# Altium project F429_PCB.PrjPcb
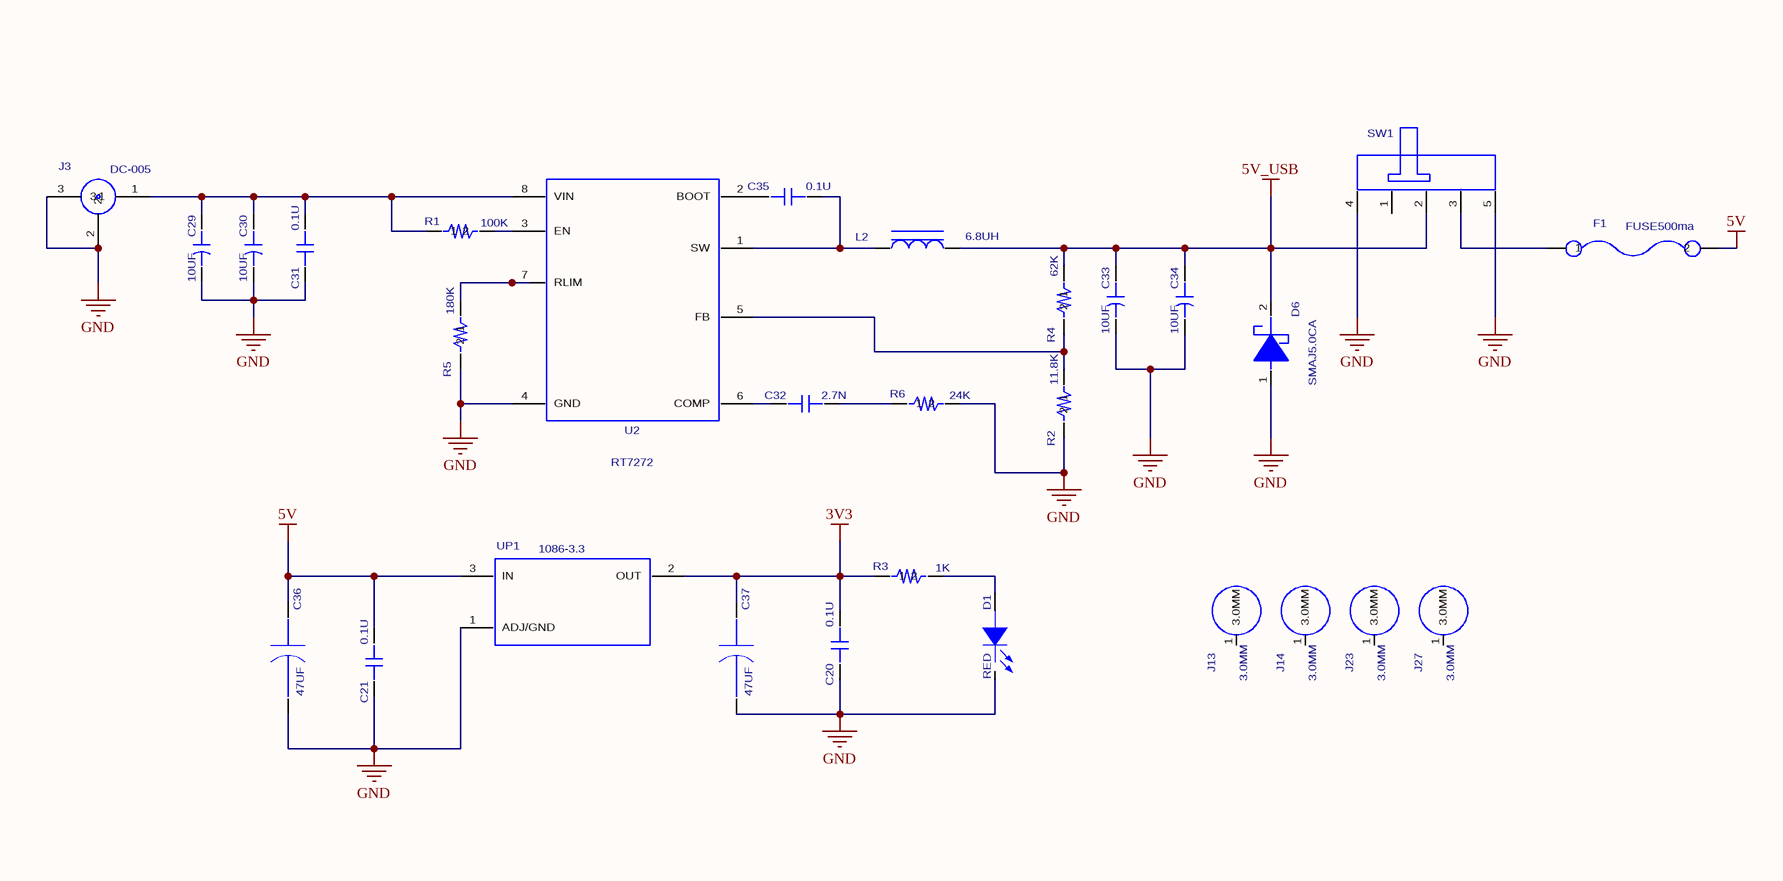
[diagram p0: Sheet1.SchDoc, top left]
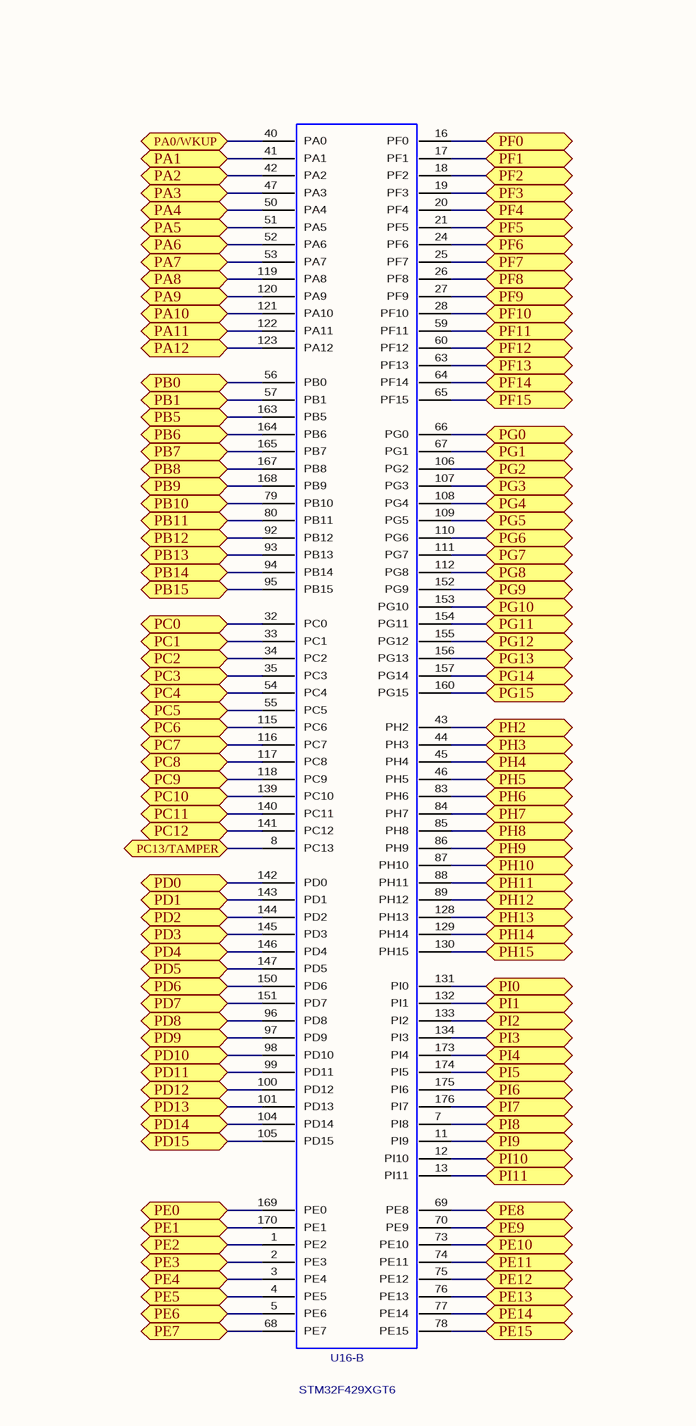
[diagram p1: Sheet1.SchDoc, top middle]
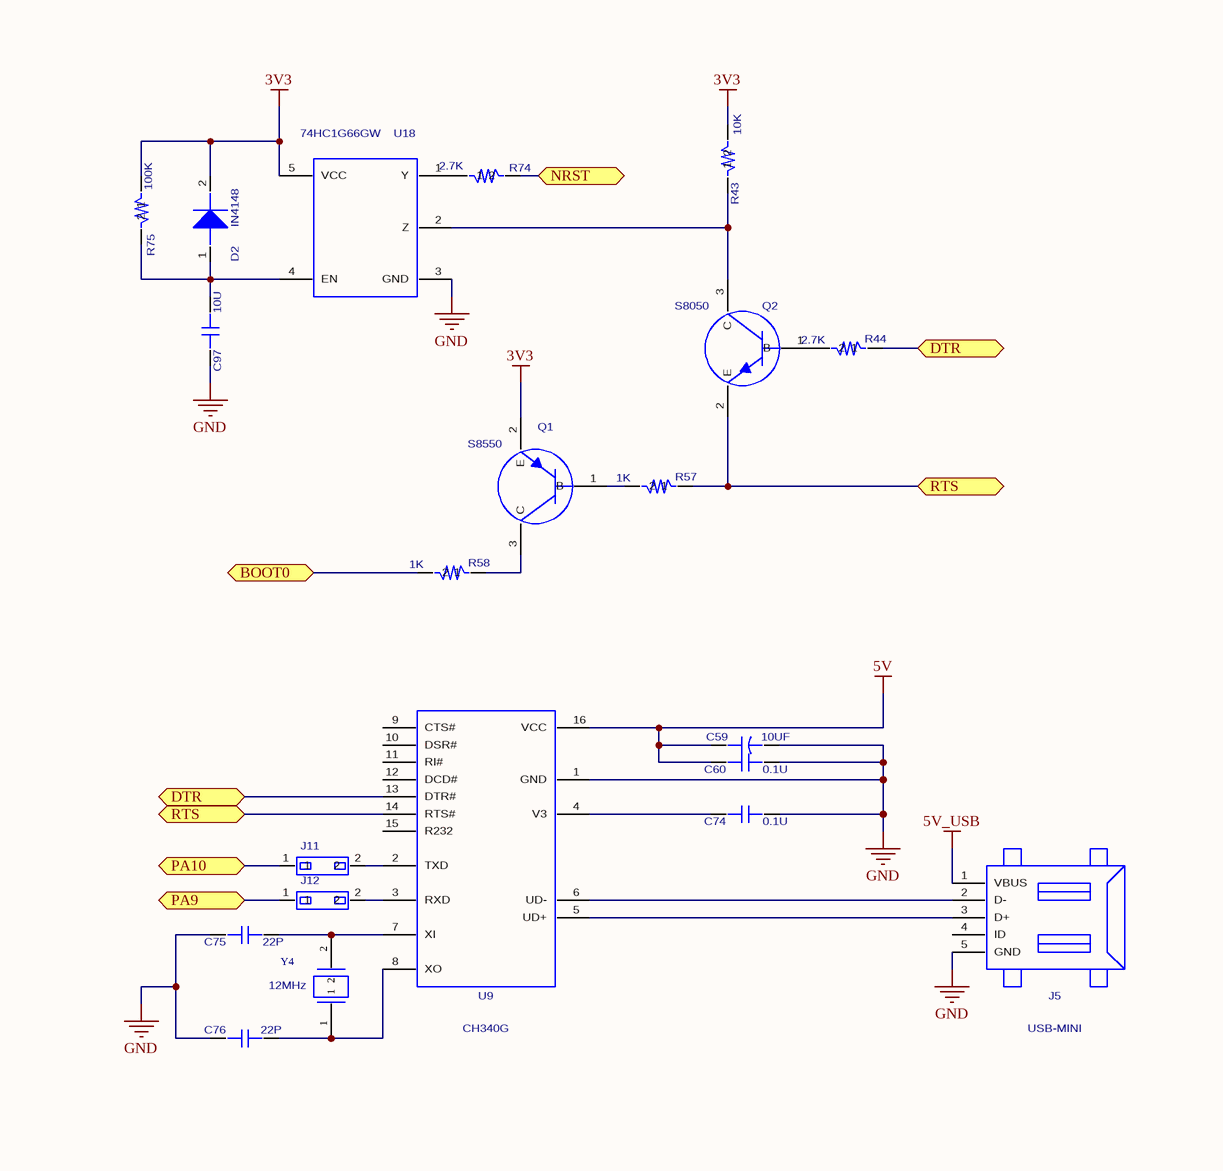
[diagram p2: Sheet1.SchDoc, top right]
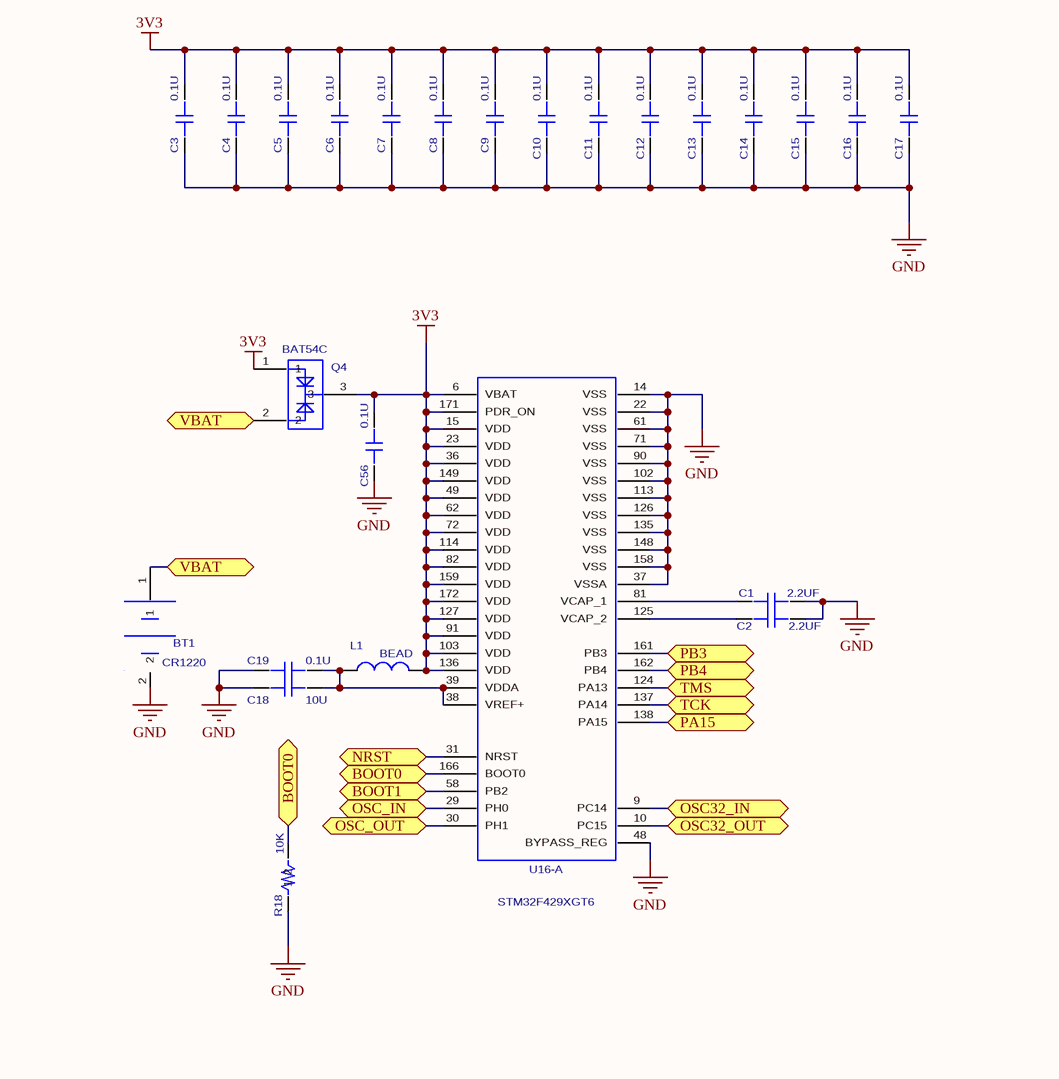
[diagram p3: Sheet1.SchDoc, centre left]
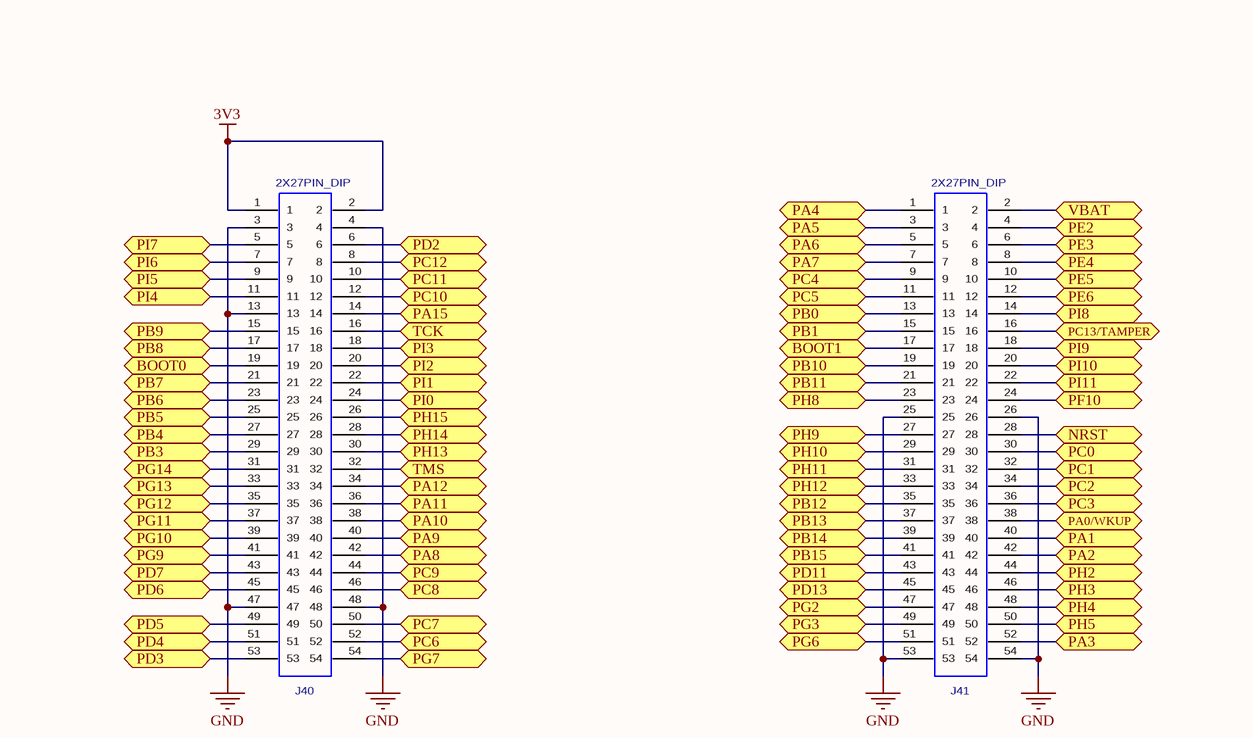
[diagram p4: Sheet1.SchDoc, centre middle]
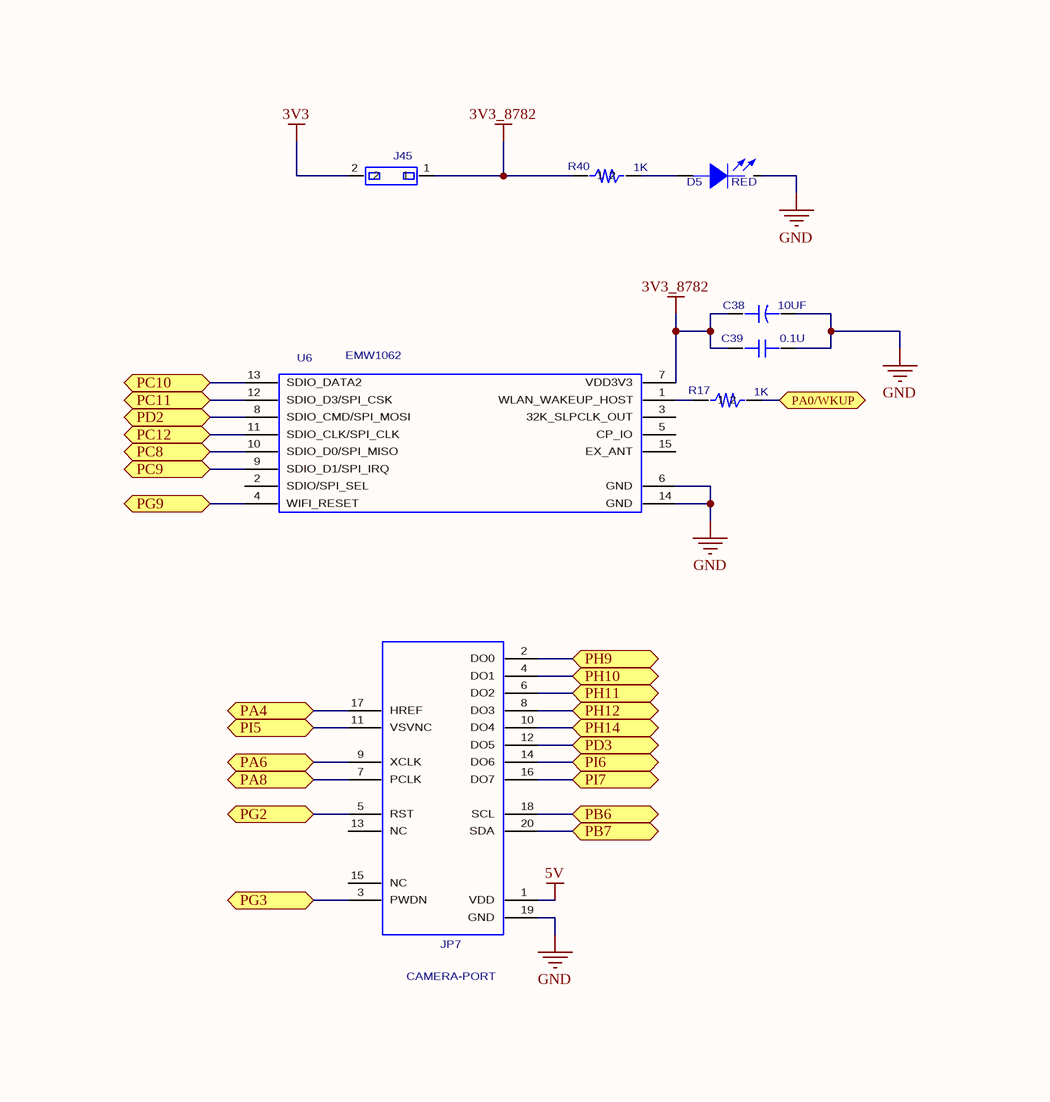
[diagram p5: Sheet1.SchDoc, centre right]
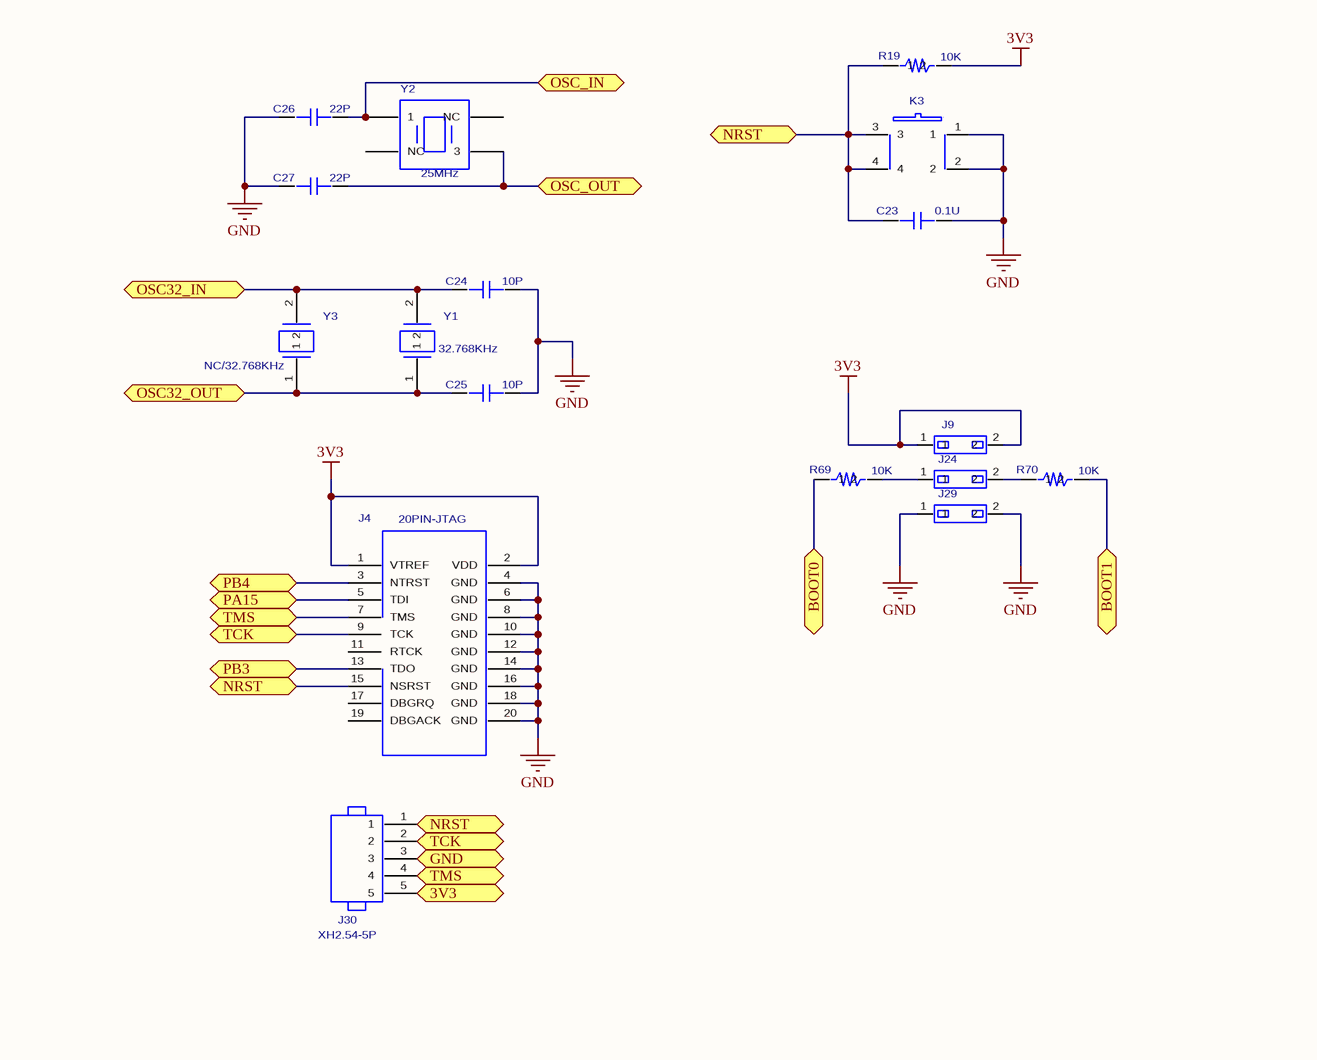
[diagram p6: Sheet1.SchDoc, bottom left]
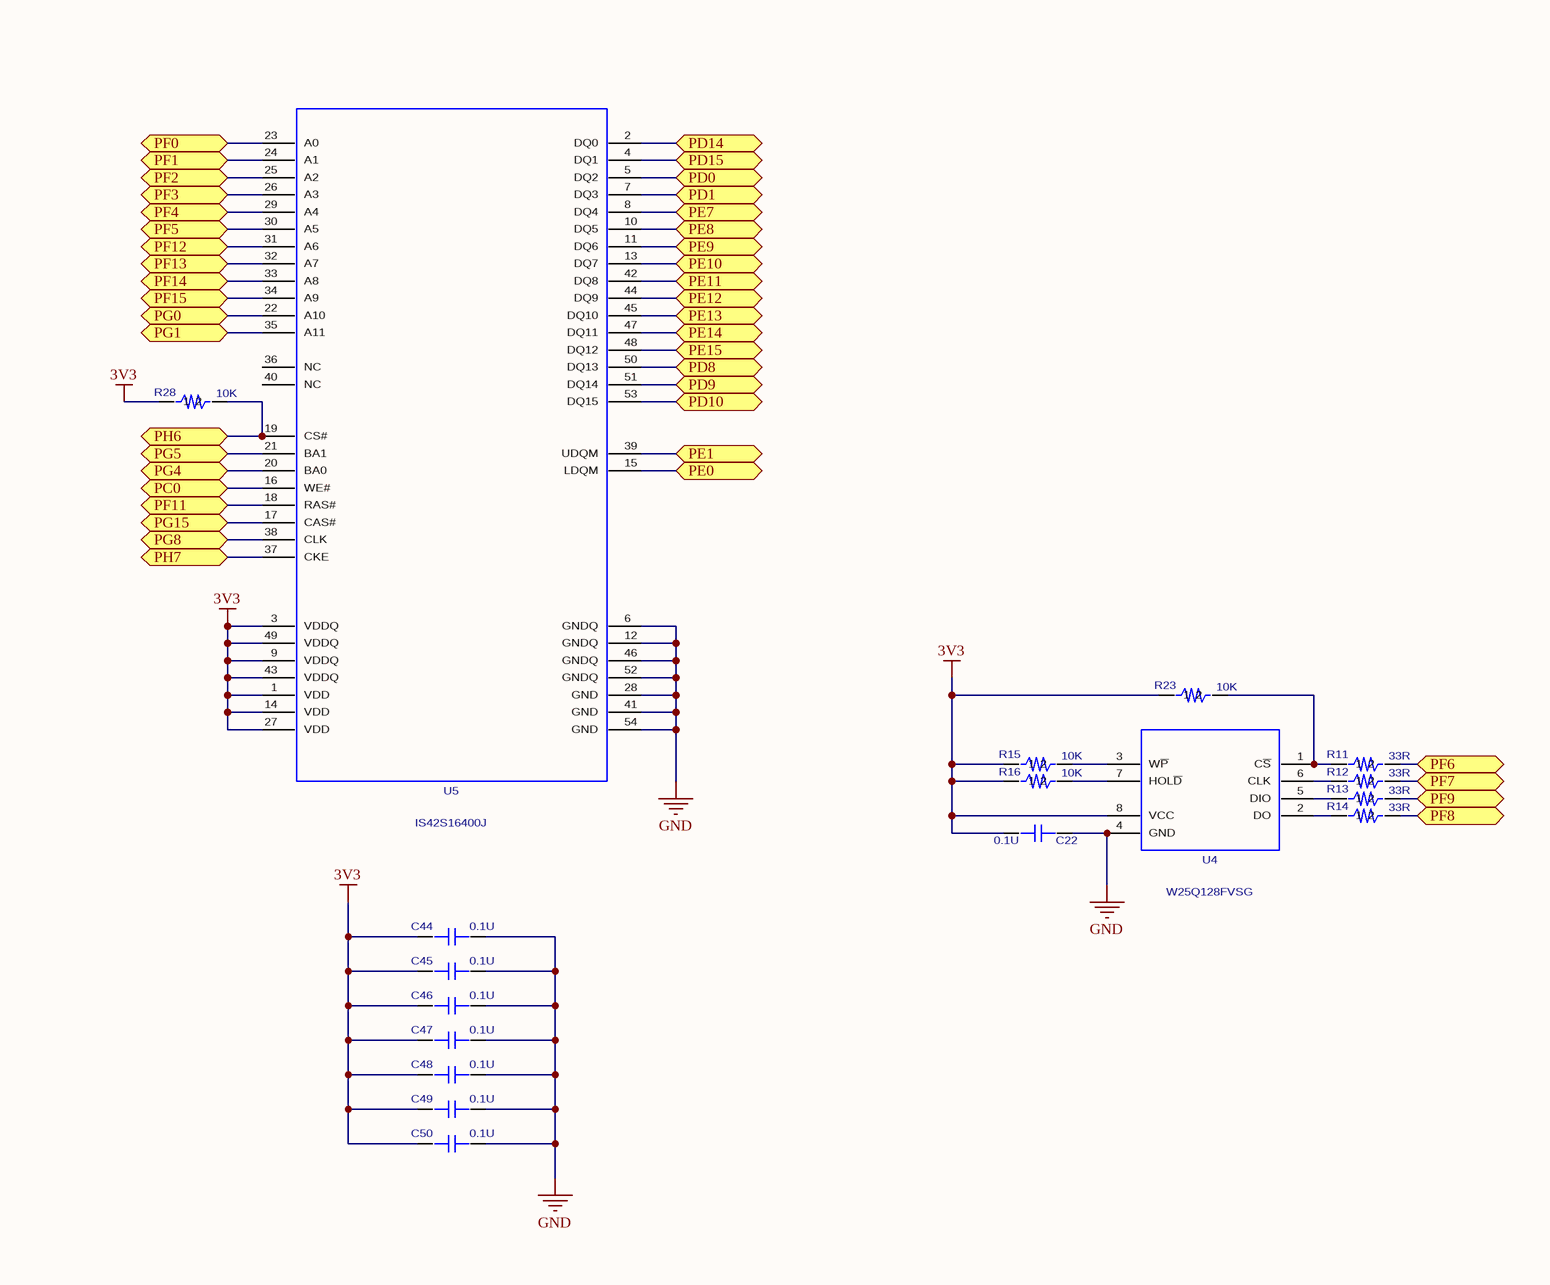
[diagram p7: Sheet1.SchDoc, bottom right]
1 sheet, 120 parts. Net scope: flat (ports and power ports of the same name join across sheets).
Board file: Board_PCB.PcbDoc

## Sheet Sheet1.SchDoc
size A1

### Parts
BT1  CR1220  [BATERY]
C1  value 2.2UF  [CAP_0603_FIRE]  (hidden comment: C_2.2UF_0603)
C2  value 2.2UF  [CAP_0603_FIRE]  (hidden comment: C_2.2UF_0603)
C3  value 0.1U  [C_0603]  (hidden comment: C_0.1UF_0603)
C4  value 0.1U  [C_0603]  (hidden comment: C_0.1UF_0603)
C5  value 0.1U  [C_0603]  (hidden comment: C_0.1UF_0603)
C6  value 0.1U  [C_0603]  (hidden comment: C_0.1UF_0603)
C7  value 0.1U  [C_0603]  (hidden comment: C_0.1UF_0603)
C8  value 0.1U  [C_0603]  (hidden comment: C_0.1UF_0603)
C9  value 0.1U  [C_0603]  (hidden comment: C_0.1UF_0603)
C10  value 0.1U  [C_0603]  (hidden comment: C_0.1UF_0603)
C11  value 0.1U  [C_0603]  (hidden comment: C_0.1UF_0603)
C12  value 0.1U  [C_0603]  (hidden comment: C_0.1UF_0603)
C13  value 0.1U  [C_0603]  (hidden comment: C_0.1UF_0603)
C14  value 0.1U  [C_0603]  (hidden comment: C_0.1UF_0603)
C15  value 0.1U  [C_0603]  (hidden comment: C_0.1UF_0603)
C16  value 0.1U  [C_0603]  (hidden comment: C_0.1UF_0603)
C17  value 0.1U  [C_0603]  (hidden comment: C_0.1UF_0603)
C18  value 10U  [C_0603]  (hidden comment: C_10UF_0603)
C19  value 0.1U  [C_0603]  (hidden comment: C_0.1UF_0603)
C20  value 0.1U  [C_0603]  (hidden comment: C_0.1UF_0603)
C21  value 0.1U  [C_0603]  (hidden comment: C_0.1UF_0603)
C22  value 0.1U  [C_0603]  (hidden comment: C_0.1UF_0603)
C23  value 0.1U  [C_0603]  (hidden comment: C_0.1UF_0603)
C24  value 10P  [C_0603]  (hidden comment: C_10P_0603)
C25  value 10P  [C_0603]  (hidden comment: C_10P_0603)
C26  value 22P  [C_0603]  (hidden comment: C_22P_0603)
C27  value 22P  [C_0603]  (hidden comment: C_22P_0603)
C29  value 10UF  [AVX_B_3528-21]  (hidden comment: C+_10UF_B)
C30  value 10UF  [AVX_B_3528-21]  (hidden comment: C+_10UF_B)
C31  value 0.1U  [C_0603]  (hidden comment: C_0.1UF_0603)
C32  value 2.7N  [C_0603]  (hidden comment: C_2.7NF_0603)
C33  value 10UF  [AVX_B_3528-21]  (hidden comment: C+_10UF_B)
C34  value 10UF  [AVX_B_3528-21]  (hidden comment: C+_10UF_B)
C35  value 0.1U  [C_0603]  (hidden comment: C_0.1UF_0603)
C36  value 47UF  [EC_47UF_6.5X6.5]  (hidden comment: CAP+_47UF_6.5X6.5)
C37  value 47UF  [EC_47UF_6.5X6.5]  (hidden comment: CAP+_47UF_6.5X6.5)
C38  value 10UF  [AVX_B_3528-21]  (hidden comment: C+_10UF_B)
C39  value 0.1U  [C_0603]  (hidden comment: C_0.1UF_0603)
C44  value 0.1U  [C_0603]  (hidden comment: C_0.1UF_0603)
C45  value 0.1U  [C_0603]  (hidden comment: C_0.1UF_0603)
C46  value 0.1U  [C_0603]  (hidden comment: C_0.1UF_0603)
C47  value 0.1U  [C_0603]  (hidden comment: C_0.1UF_0603)
C48  value 0.1U  [C_0603]  (hidden comment: C_0.1UF_0603)
C49  value 0.1U  [C_0603]  (hidden comment: C_0.1UF_0603)
C50  value 0.1U  [C_0603]  (hidden comment: C_0.1UF_0603)
C56  value 0.1U  [C_0603]  (hidden comment: C_0.1UF_0603)
C59  value 10UF  [C_0603]  (hidden comment: C_10UF)
C60  value 0.1U  [C_0603]  (hidden comment: C_0.1UF_0603)
C74  value 0.1U  [C_0603]  (hidden comment: C_0.1UF_0603)
C75  value 22P  [C_0603]  (hidden comment: C_22P_0603)
C76  value 22P  [C_0603]  (hidden comment: C_22P_0603)
C97  value 10U  [C_0603]  (hidden comment: C_10UF_0603)
D1  value RED  [LED_0603]  (hidden comment: LED_RED_0603)
D2  IN4148  [DIODE_SOP]
D5  value RED  [LED_0603]  (hidden comment: LED_RED_0603)
D6  SMAJ5.0CA  [DO-214]
F1  FUSE500MA  [C1812]
J3  DC-005  [DC-005]
J4  20PIN-JTAG  [20PIN-JTAG]
J5  USB-MINI  [USB-MINI]
J9  1X2PIN_SMD  [1X2PIN_SMD]  (value not drawn)
J11  1X2PIN_SMD  [1X2PIN_SMD]  (value not drawn)
J12  1X2PIN_SMD  [1X2PIN_SMD]  (value not drawn)
J13  3.0MM  [3.0MM]
J14  3.0MM  [3.0MM]
J23  3.0MM  [3.0MM]
J24  1X2PIN_SMD  [1X2PIN_SMD]  (value not drawn)
J27  3.0MM  [3.0MM]
J29  1X2PIN_SMD  [1X2PIN_SMD]  (value not drawn)
J30  XH2.54-5P  [XH2.54-5P]
J40  2X27PIN_DIP  [2X27X2.54MM]
J41  2X27PIN_DIP  [2X27X2.54MM]
J45  1X2PIN_SMD  [1X2PIN_SMD]  (value not drawn)
JP7  CAMERA-PORT  [20PIN_2.54_DIP_BOT]
K3  KEY  [SW6.2/6.2-SMD]  (value not drawn)
L1  value BEAD  [R_0603]  (hidden comment: BEAD-0603)
L2  value 6.8UH  [GDCD4532]  (hidden comment: L_6.8UH_4532)
Q1  S8550  [SOT-23]
Q2  S8050  [SOT-23]
Q4  BAT54C  [SOT-23]
R1  value 100K  [R_0603]  (hidden comment: R_100K_0603)
R2  value 11.8K  [R_0603]  (hidden comment: R_11.8K_0603)
R3  value 1K  [R_0603]  (hidden comment: R_1K_0603)
R4  value 62K  [R_0603]  (hidden comment: R_62K_0603)
R5  value 180K  [R_0603]  (hidden comment: R_180K_0603)
R6  value 24K  [R_0603]  (hidden comment: R_24K_0603)
R11  value 33R  [SR0402]  (hidden comment: R_33R_0402)
R12  value 33R  [SR0402]  (hidden comment: R_33R_0402)
R13  value 33R  [SR0402]  (hidden comment: R_33R_0402)
R14  value 33R  [SR0402]  (hidden comment: R_33R_0402)
R15  value 10K  [R_0603]  (hidden comment: R_10K_0603)
R16  value 10K  [R_0603]  (hidden comment: R_10K_0603)
R17  value 1K  [R_0603]  (hidden comment: R_1K_0603)
R18  value 10K  [R_0603]  (hidden comment: R_10K_0603)
R19  value 10K  [R_0603]  (hidden comment: R_10K_0603)
R23  value 10K  [R_0603]  (hidden comment: R_10K_0603)
R28  value 10K  [R_0603]  (hidden comment: R_10K_0603)
R40  value 1K  [R_0603]  (hidden comment: R_1K_0603)
R43  value 10K  [R_0603]  (hidden comment: R_10K_0603)
R44  value 2.7K  [R_0603]  (hidden comment: R_2.7K_0603)
R57  value 1K  [R_0603]  (hidden comment: R_1K_0603)
R58  value 1K  [R_0603]  (hidden comment: R_1K_0603)
R69  value 10K  [R_0603]  (hidden comment: R_10K_0603)
R70  value 10K  [R_0603]  (hidden comment: R_10K_0603)
R74  value 2.7K  [R_0603]  (hidden comment: R_2.7K_0603)
R75  value 100K  [R_0603]  (hidden comment: R_100K_0603)
SW1  SW-POWER  [SW13_6]  (value not drawn)
U2  RT7272  [RT7272]
U4  W25Q128FVSG  [W25X16]
U5  IS42S16400J  [TSOP-54]
U6  EMW1062  [EMW1062]
U9  CH340G  [SOP16]
U16-  STM32F429XGT6  [LQFP176]  (parts A,B of 2)
U18  74HC1G66GW  [SOT-353]
UP1  1086-3.3  [TO-252-2L]
Y1  value 32.768KHz  [CRYS-3X8]  (hidden comment: XTAL_32.768KHZ)
Y2  value 25MHz  [CRYSTAL_25MHZ]  (hidden comment: CRYSTAL_25MHZ)
Y3  value NC/32.768KHz  [3215]  (hidden comment: NC/XTAL_32.768KHZ_3215)
Y4  value 12MHz  [XTAL_SMD]  (hidden comment: XTAL_12M)

### Ports
3V3, BOOT0, BOOT1, DTR, GND, NRST, OSC32_IN, OSC32_OUT, OSC_IN, OSC_OUT, PA0/WKUP, PA1, PA2, PA3, PA4, PA5, PA6, PA7, PA8, PA9, PA10, PA11, PA12, PA15, PB0, PB1, PB3, PB4, PB5, PB6, PB7, PB8, PB9, PB10, PB11, PB12, PB13, PB14, PB15, PC0, PC1, PC2, PC3, PC4, PC5, PC6, PC7, PC8, PC9, PC10, PC11, PC12, PC13/TAMPER, PD0, PD1, PD2, PD3, PD4, PD5, PD6, PD7, PD8, PD9, PD10, PD11, PD12, PD13, PD14, PD15, PE0, PE1, PE2, PE3, PE4, PE5, PE6, PE7, PE8, PE9, PE10, PE11, PE12, PE13, PE14, PE15, PF0, PF1, PF2, PF3, PF4, PF5, PF6, PF7, PF8, PF9, PF10, PF11, PF12, PF13, PF14, PF15, PG0, PG1, PG2, PG3, PG4, PG5, PG6, PG7, PG8, PG9, PG10, PG11, PG12, PG13, PG14, PG15, PH2, PH3, PH4, PH5, PH6, PH7, PH8, PH9, PH10, PH11, PH12, PH13, PH14, PH15, PI0, PI1, PI2, PI3, PI4, PI5, PI6, PI7, PI8, PI9, PI10, PI11, RTS, TCK, TMS, VBAT

### Nets
3V3: C3.1 C4.1 C5.1 C6.1 C7.1 C8.1 C9.1 C10.1 C11.1 C12.1 C13.1 C14.1 C15.1 C16.1 C17.1 C20.1 C22.1 C37.1 C44.2 C45.2 C46.2 C47.2 C48.2 C49.2 C50.2 C56.1 D2.2(-) J4.1(VTREF) J4.2(VDD) J9.1 J9.2 J40.1 J40.2 J45.2 L1.2 Q1.2(E) Q4.1 Q4.3 R3.1 R15.1 R16.1 R19.2 R23.1 R28.1 R43.2 R75.1 U4.8(VCC) U5.1(VDD) U5.3(VDDQ) U5.9(VDDQ) U5.14(VDD) U5.27(VDD) U5.43(VDDQ) U5.49(VDDQ) U16-.6(VBAT) U16-.15(VDD) U16-.23(VDD) U16-.36(VDD) U16-.49(VDD) U16-.62(VDD) U16-.72(VDD) U16-.82(VDD) U16-.91(VDD) U16-.103(VDD) U16-.114(VDD) U16-.127(VDD) U16-.136(VDD) U16-.149(VDD) U16-.159(VDD) U16-.171(PDR_ON) U16-.172(VDD) U18.5(VCC) UP1.2(OUT)
3V3_8782: C38.1(+) C39.2 J45.1 R40.1 U6.7(VDD3V3)
5V: C21.1 C36.1 C59.1(+) C60.2 F1.2 JP7.1(VDD) U9.16(VCC) UP1.3(IN)
5V_USB: C33.1(+) C34.1(+) D6.2(-) J5.1(VBUS) L2.2 R4.1 SW1.2
GND: BT1.2 C1.2 C2.2 C3.2 C4.2 C5.2 C6.2 C7.2 C8.2 C9.2 C10.2 C11.2 C12.2 C13.2 C14.2 C15.2 C16.2 C17.2 C18.2 C19.2 C20.2 C21.2 C22.2 C23.1 C24.2 C25.2 C26.1 C27.1 C29.2(-) C30.2(-) C31.2 C33.2(-) C34.2(-) C36.2 C37.2 C38.2(-) C39.1 C44.1 C45.1 C46.1 C47.1 C48.1 C49.1 C50.1 C56.2 C59.2(-) C60.1 C74.1 C75.1 C76.1 C97.1 D1.K(CATHODE) D5.K(CATHODE) D6.1(+) J3.2 J3.3 J4.4(GND) J4.6(GND) J4.8(GND) J4.10(GND) J4.12(GND) J4.14(GND) J4.16(GND) J4.18(GND) J4.20(GND) J5.5(GND) J29.1 J29.2 J40.3 J40.4 J40.13 J40.47 J40.48 J41.25 J41.26 J41.53 J41.54 JP7.19(GND) K3.1 K3.2 R2.2 R5.2 R6.2 R18.1 SW1.4 SW1.5 U2.4(GND) U4.4(GND) U5.6(GNDQ) U5.12(GNDQ) U5.28(GND) U5.41(GND) U5.46(GNDQ) U5.52(GNDQ) U5.54(GND) U6.6(GND) U6.14(GND) U9.1(GND) U16-.14(VSS) U16-.22(VSS) U16-.37(VSSA) U16-.48(BYPASS_REG) U16-.61(VSS) U16-.71(VSS) U16-.90(VSS) U16-.102(VSS) U16-.113(VSS) U16-.126(VSS) U16-.135(VSS) U16-.148(VSS) U16-.158(VSS) U18.3(GND) UP1.1(ADJ/GND)
NetBT1_1: BT1.1 J41.2 Q4.2 ; port VBAT
NetC1_1: C1.1 U16-.81(VCAP_1)
NetC2_1: C2.1 U16-.125(VCAP_2)
NetC18_1: C18.1 C19.1 L1.1 U16-.38(VREF+) U16-.39(VDDA)
NetC23_2: C23.2 J4.15(NSRST) J30.1 J41.28 K3.3 K3.4 R19.1 R74.2 U16-.31(NRST) ; port NRST
NetC24_1: C24.1 U16-.9(PC14) Y1.2 Y3.2 ; port OSC32_IN
NetC25_1: C25.1 U16-.10(PC15) Y1.1 Y3.1 ; port OSC32_OUT
NetC26_2: C26.2 U16-.29(PH0) Y2.1 ; port OSC_IN
NetC27_2: C27.2 U16-.30(PH1) Y2.3 ; port OSC_OUT
NetC29_1: C29.1(+) C30.1(+) C31.1 J3.1 R1.1 U2.8(VIN)
NetC32_1: C32.1 U2.6(COMP)
NetC32_2: C32.2 R6.1
NetC35_1: C35.1 L2.1 U2.1(SW)
NetC35_2: C35.2 U2.2(BOOT)
NetC74_2: C74.2 U9.4(V3)
NetC75_2: C75.2 U9.7(XI) Y4.2
NetC76_2: C76.2 U9.8(XO) Y4.1
NetC97_2: C97.2 D2.1(+) R75.2 U18.4(EN)
NetD1_A: D1.A(ANODE) R3.2
NetD5_A: D5.A(ANODE) R40.2
NetF1_1: F1.1 SW1.3
NetJ4_3: J4.3(NTRST) J40.27 U16-.162(PB4) ; port PB4
NetJ4_5: J4.5(TDI) J40.14 U16-.138(PA15) ; port PA15
NetJ4_7: J4.7(TMS) J30.4 J40.32 U16-.124(PA13) ; port TMS
NetJ4_9: J4.9(TCK) J30.2 J40.16 U16-.137(PA14) ; port TCK
NetJ4_13: J4.13(TDO) J40.29 U16-.161(PB3) ; port PB3
NetJ5_2: J5.2(D-) U9.6(UD-)
NetJ5_3: J5.3(D+) U9.5(UD+)
NetJ11_1: J11.1 J40.38 U16-.121(PA10) ; port PA10
NetJ11_2: J11.2 U9.2(TXD)
NetJ12_1: J12.1 J40.40 U16-.120(PA9) ; port PA9
NetJ12_2: J12.2 U9.3(RXD)
NetJ24_1: J24.1 R69.2
NetJ24_2: J24.2 R70.1
NetJ30_3: J30.3 ; port GND
NetJ30_5: J30.5 ; port 3V3
NetJ40_5: J40.5 JP7.16(DO7) U16-.176(PI7) ; port PI7
NetJ40_6: J40.6 U6.8(SDIO_CMD/SPI_MOSI) U16-.144(PD2) ; port PD2
NetJ40_7: J40.7 JP7.14(DO6) U16-.175(PI6) ; port PI6
NetJ40_8: J40.8 U6.11(SDIO_CLK/SPI_CLK) U16-.141(PC12) ; port PC12
NetJ40_9: J40.9 JP7.11(VSVNC) U16-.174(PI5) ; port PI5
NetJ40_10: J40.10 U6.12(SDIO_D3/SPI_CSK) U16-.140(PC11) ; port PC11
NetJ40_11: J40.11 U16-.173(PI4) ; port PI4
NetJ40_12: J40.12 U6.13(SDIO_DATA2) U16-.139(PC10) ; port PC10
NetJ40_15: J40.15 U16-.168(PB9) ; port PB9
NetJ40_17: J40.17 U16-.167(PB8) ; port PB8
NetJ40_18: J40.18 U16-.134(PI3) ; port PI3
NetJ40_19: J40.19 R18.2 R58.2 R69.1 U16-.166(BOOT0) ; port BOOT0
NetJ40_20: J40.20 U16-.133(PI2) ; port PI2
NetJ40_21: J40.21 JP7.20(SDA) U16-.165(PB7) ; port PB7
NetJ40_22: J40.22 U16-.132(PI1) ; port PI1
NetJ40_23: J40.23 JP7.18(SCL) U16-.164(PB6) ; port PB6
NetJ40_24: J40.24 U16-.131(PI0) ; port PI0
NetJ40_25: J40.25 U16-.163(PB5) ; port PB5
NetJ40_26: J40.26 U16-.130(PH15) ; port PH15
NetJ40_28: J40.28 JP7.10(DO4) U16-.129(PH14) ; port PH14
NetJ40_30: J40.30 U16-.128(PH13) ; port PH13
NetJ40_31: J40.31 U16-.157(PG14) ; port PG14
NetJ40_33: J40.33 U16-.156(PG13) ; port PG13
NetJ40_34: J40.34 U16-.123(PA12) ; port PA12
NetJ40_35: J40.35 U16-.155(PG12) ; port PG12
NetJ40_36: J40.36 U16-.122(PA11) ; port PA11
NetJ40_37: J40.37 U16-.154(PG11) ; port PG11
NetJ40_39: J40.39 U16-.153(PG10) ; port PG10
NetJ40_41: J40.41 U6.4(WIFI_RESET) U16-.152(PG9) ; port PG9
NetJ40_42: J40.42 JP7.7(PCLK) U16-.119(PA8) ; port PA8
NetJ40_43: J40.43 U16-.151(PD7) ; port PD7
NetJ40_44: J40.44 U6.9(SDIO_D1/SPI_IRQ) U16-.118(PC9) ; port PC9
NetJ40_45: J40.45 U16-.150(PD6) ; port PD6
NetJ40_46: J40.46 U6.10(SDIO_D0/SPI_MISO) U16-.117(PC8) ; port PC8
NetJ40_49: J40.49 U16-.147(PD5) ; port PD5
NetJ40_50: J40.50 U16-.116(PC7) ; port PC7
NetJ40_51: J40.51 U16-.146(PD4) ; port PD4
NetJ40_52: J40.52 U16-.115(PC6) ; port PC6
NetJ40_53: J40.53 JP7.12(DO5) U16-.145(PD3) ; port PD3
NetJ40_54: J40.54 U16-.111(PG7) ; port PG7
NetJ41_1: J41.1 JP7.17(HREF) U16-.50(PA4) ; port PA4
NetJ41_3: J41.3 U16-.51(PA5) ; port PA5
NetJ41_4: J41.4 U16-.1(PE2) ; port PE2
NetJ41_5: J41.5 JP7.9(XCLK) U16-.52(PA6) ; port PA6
NetJ41_6: J41.6 U16-.2(PE3) ; port PE3
NetJ41_7: J41.7 U16-.53(PA7) ; port PA7
NetJ41_8: J41.8 U16-.3(PE4) ; port PE4
NetJ41_9: J41.9 U16-.54(PC4) ; port PC4
NetJ41_10: J41.10 U16-.4(PE5) ; port PE5
NetJ41_11: J41.11 U16-.55(PC5) ; port PC5
NetJ41_12: J41.12 U16-.5(PE6) ; port PE6
NetJ41_13: J41.13 U16-.56(PB0) ; port PB0
NetJ41_14: J41.14 U16-.7(PI8) ; port PI8
NetJ41_15: J41.15 U16-.57(PB1) ; port PB1
NetJ41_16: J41.16 U16-.8(PC13) ; port PC13/TAMPER
NetJ41_17: J41.17 R70.2 U16-.58(PB2) ; port BOOT1
NetJ41_18: J41.18 U16-.11(PI9) ; port PI9
NetJ41_19: J41.19 U16-.79(PB10) ; port PB10
NetJ41_20: J41.20 U16-.12(PI10) ; port PI10
NetJ41_21: J41.21 U16-.80(PB11) ; port PB11
NetJ41_22: J41.22 U16-.13(PI11) ; port PI11
NetJ41_23: J41.23 U16-.85(PH8) ; port PH8
NetJ41_24: J41.24 U16-.28(PF10) ; port PF10
NetJ41_27: J41.27 JP7.2(DO0) U16-.86(PH9) ; port PH9
NetJ41_29: J41.29 JP7.4(DO1) U16-.87(PH10) ; port PH10
NetJ41_30: J41.30 U5.16(WE#) U16-.32(PC0) ; port PC0
NetJ41_31: J41.31 JP7.6(DO2) U16-.88(PH11) ; port PH11
NetJ41_32: J41.32 U16-.33(PC1) ; port PC1
NetJ41_33: J41.33 JP7.8(DO3) U16-.89(PH12) ; port PH12
NetJ41_34: J41.34 U16-.34(PC2) ; port PC2
NetJ41_35: J41.35 U16-.92(PB12) ; port PB12
NetJ41_36: J41.36 U16-.35(PC3) ; port PC3
NetJ41_37: J41.37 U16-.93(PB13) ; port PB13
NetJ41_38: J41.38 R17.2 U16-.40(PA0) ; port PA0/WKUP
NetJ41_39: J41.39 U16-.94(PB14) ; port PB14
NetJ41_40: J41.40 U16-.41(PA1) ; port PA1
NetJ41_41: J41.41 U16-.95(PB15) ; port PB15
NetJ41_42: J41.42 U16-.42(PA2) ; port PA2
NetJ41_43: J41.43 U16-.99(PD11) ; port PD11
NetJ41_44: J41.44 U16-.43(PH2) ; port PH2
NetJ41_45: J41.45 U16-.101(PD13) ; port PD13
NetJ41_46: J41.46 U16-.44(PH3) ; port PH3
NetJ41_47: J41.47 JP7.5(RST) U16-.106(PG2) ; port PG2
NetJ41_48: J41.48 U16-.45(PH4) ; port PH4
NetJ41_49: J41.49 JP7.3(PWDN) U16-.107(PG3) ; port PG3
NetJ41_50: J41.50 U16-.46(PH5) ; port PH5
NetJ41_51: J41.51 U16-.110(PG6) ; port PG6
NetJ41_52: J41.52 U16-.47(PA3) ; port PA3
NetQ1_1: Q1.1(B) R57.2
NetQ1_3: Q1.3(C) R58.1
NetQ2_1: Q2.1(B) R44.2
NetQ2_2: Q2.2(E) R57.1 U9.14(RTS#) ; port RTS
NetQ2_3: Q2.3(C) R43.1 U18.2(Z)
NetR1_2: R1.2 U2.3(EN)
NetR2_1: R2.1 R4.2 U2.5(FB)
NetR5_1: R5.1 U2.7(RLIM)
NetR11_1: R11.1 R23.2 U4.1(C~{S})
NetR11_2: R11.2 U16-.24(PF6) ; port PF6
NetR12_1: R12.1 U4.6(CLK)
NetR12_2: R12.2 U16-.25(PF7) ; port PF7
NetR13_1: R13.1 U4.5(DIO)
NetR13_2: R13.2 U16-.27(PF9) ; port PF9
NetR14_1: R14.1 U4.2(DO)
NetR14_2: R14.2 U16-.26(PF8) ; port PF8
NetR15_2: R15.2 U4.3(W~{P})
NetR16_2: R16.2 U4.7(HOL~{D})
NetR17_1: R17.1 U6.1(WLAN_WAKEUP_HOST)
NetR28_2: R28.2 U5.19(CS#) U16-.83(PH6) ; port PH6
NetR44_1: R44.1 U9.13(DTR#) ; port DTR
NetR74_1: R74.1 U18.1(Y)
NetU5_2: U5.2(DQ0) U16-.104(PD14) ; port PD14
NetU5_4: U5.4(DQ1) U16-.105(PD15) ; port PD15
NetU5_5: U5.5(DQ2) U16-.142(PD0) ; port PD0
NetU5_7: U5.7(DQ3) U16-.143(PD1) ; port PD1
NetU5_8: U5.8(DQ4) U16-.68(PE7) ; port PE7
NetU5_10: U5.10(DQ5) U16-.69(PE8) ; port PE8
NetU5_11: U5.11(DQ6) U16-.70(PE9) ; port PE9
NetU5_13: U5.13(DQ7) U16-.73(PE10) ; port PE10
NetU5_15: U5.15(LDQM) U16-.169(PE0) ; port PE0
NetU5_17: U5.17(CAS#) U16-.160(PG15) ; port PG15
NetU5_18: U5.18(RAS#) U16-.59(PF11) ; port PF11
NetU5_20: U5.20(BA0) U16-.108(PG4) ; port PG4
NetU5_21: U5.21(BA1) U16-.109(PG5) ; port PG5
NetU5_22: U5.22(A10) U16-.66(PG0) ; port PG0
NetU5_23: U5.23(A0) U16-.16(PF0) ; port PF0
NetU5_24: U5.24(A1) U16-.17(PF1) ; port PF1
NetU5_25: U5.25(A2) U16-.18(PF2) ; port PF2
NetU5_26: U5.26(A3) U16-.19(PF3) ; port PF3
NetU5_29: U5.29(A4) U16-.20(PF4) ; port PF4
NetU5_30: U5.30(A5) U16-.21(PF5) ; port PF5
NetU5_31: U5.31(A6) U16-.60(PF12) ; port PF12
NetU5_32: U5.32(A7) U16-.63(PF13) ; port PF13
NetU5_33: U5.33(A8) U16-.64(PF14) ; port PF14
NetU5_34: U5.34(A9) U16-.65(PF15) ; port PF15
NetU5_35: U5.35(A11) U16-.67(PG1) ; port PG1
NetU5_37: U5.37(CKE) U16-.84(PH7) ; port PH7
NetU5_38: U5.38(CLK) U16-.112(PG8) ; port PG8
NetU5_39: U5.39(UDQM) U16-.170(PE1) ; port PE1
NetU5_42: U5.42(DQ8) U16-.74(PE11) ; port PE11
NetU5_44: U5.44(DQ9) U16-.75(PE12) ; port PE12
NetU5_45: U5.45(DQ10) U16-.76(PE13) ; port PE13
NetU5_47: U5.47(DQ11) U16-.77(PE14) ; port PE14
NetU5_48: U5.48(DQ12) U16-.78(PE15) ; port PE15
NetU5_50: U5.50(DQ13) U16-.96(PD8) ; port PD8
NetU5_51: U5.51(DQ14) U16-.97(PD9) ; port PD9
NetU5_53: U5.53(DQ15) U16-.98(PD10) ; port PD10
NetU16-_100: U16-.100(PD12) ; port PD12

Not connected (* = marked no-connect by the designer): J4 11(RTCK) 17(DBGRQ) 19(DBGACK); J5 4(ID); J13 1(3.0MM); J14 1(3.0MM); J23 1(3.0MM); J27 1(3.0MM); JP7 13(NC) 15(NC); SW1 1; U5 36(NC) 40(NC); U6 2(SDIO/SPI_SEL) 3(32K_SLPCLK_OUT) 5(CP_IO) 15(EX_ANT); U9 9(CTS#) 10(DSR#) 11(RI#) 12(DCD#) 15(R232); Y2 2(NC) 4(NC)

### Library data of the parts
D6 = SMAJ5.0CA: SMAJ5.0CA-E3/61 400W 5V; Manufacture 1 P/N: SMAJ5.0CA; Value: SMAJ5.0CA; PCB DECAL: DO-214
F1 = FUSE500MA: Assembly: SMD; Manufacture 1 P/N: FUSE500ma; PCB DECAL: C1812; Value: FUSE500ma
J40 J41 = 2X27PIN_DIP: value: 2X27PIN_DIP_2.54MM; PCB DECAL: 2X27X2.54MM
Q1 = S8550: NPN; Manufacturer #2: 8050; PCB DECAL: SOT-23
Q2 = S8050: NPN; Manufacturer #2: 8050; PCB DECAL: SOT-23
SW1 = SW-POWER: SW-5; Manufacturer #1 PN: SW-5; PCB DECAL: SW13_6
UP1 = 1086-3.3: Manufacturer #1: AMS; Manufacturer #1 PN: 1086-3.3; PCB DECAL: TO-252-2L
Y3 = NC/XTAL_32.768KHZ_3215: CRYSTAL; PCB DECAL: 3215
BT1 = CR1220: PCB DECAL: BATERY
C1 C2 = C_2.2UF_0603: PCB DECAL: CAP_0603_FIRE
C3-C17 C19-C23 C31 C35 C39 C44-C50 C56 C60 C74 = C_0.1UF_0603: PCB DECAL: C_0603
C18 C97 = C_10UF_0603: PCB DECAL: C_0603
C24 C25 = C_10P_0603: PCB DECAL: C_0603
C26 C27 C75 C76 = C_22P_0603: PCB DECAL: C_0603
C29 C30 C33 C34 C38 = C+_10UF_B: PCB DECAL: AVX_B_3528-21
C32 = C_2.7NF_0603: PCB DECAL: C_0603
C36 C37 = CAP+_47UF_6.5X6.5: PCB DECAL: EC_47UF_6.5X6.5
C59 = C_10UF: PCB DECAL: C_0603
D1 D5 = LED_RED_0603: PCB DECAL: LED_0603
D2 = IN4148: PCB DECAL: DIODE_SOP; VALUE: IN4148
J3 = DC-005: PCB DECAL: DC-005
J4 = 20PIN-JTAG: PCB DECAL: 20PIN-JTAG
J5 = USB-MINI: PCB DECAL: USB-MINI
J9 J11 J12 J24 J29 J45 = 1X2PIN_SMD: PCB DECAL: 1X2PIN_SMD
J13 J14 J23 J27 = 3.0MM: PCB DECAL: 3.0MM
J30 = XH2.54-5P: PCB DECAL: XH2.54-5P
JP7 = CAMERA-PORT: Manufacture 1 P/N: CAMERA-PORT; PCB DECAL: 20PIN_2.54_DIP_BOT
K3 = KEY: Manufacturer #1 PN: KEY; PCB DECAL: SW6.2/6.2-SMD
L1 = BEAD-0603: PCB DECAL: R_0603
L2 = L_6.8UH_4532: PCB DECAL: GDCD4532
Q4 = BAT54C: Value: BAT54C; PCB DECAL: SOT-23
R1 R75 = R_100K_0603: PCB DECAL: R_0603
R2 = R_11.8K_0603: PCB DECAL: R_0603
R3 R17 R40 R57 R58 = R_1K_0603: PCB DECAL: R_0603
R4 = R_62K_0603: PCB DECAL: R_0603
R5 = R_180K_0603: PCB DECAL: R_0603
R6 = R_24K_0603: PCB DECAL: R_0603
R11-R14 = R_33R_0402: PCB DECAL: SR0402
R15 R16 R18 R19 R23 R28 R43 R69 R70 = R_10K_0603: PCB DECAL: R_0603
R44 R74 = R_2.7K_0603: PCB DECAL: R_0603
U2 = RT7272: PCB DECAL: RT7272
U4 = W25Q128FVSG: PCB DECAL: W25X16; value: W25Q128FVSG
U5 = IS42S16400J: PCB DECAL: TSOP-54
U6 = EMW1062: Value: EMW1062; PCB DECAL: EMW1062
U9 = CH340G: PCB DECAL: SOP16
U16- = STM32F429XGT6: PCB DECAL: LQFP176
U18 = 74HC1G66GW: PCB DECAL: SOT-353
Y1 = XTAL_32.768KHZ: PCB DECAL: CRYS-3X8
Y2 = CRYSTAL_25MHZ: PCB DECAL: CRYSTAL_25MHZ
Y4 = XTAL_12M: PCB DECAL: XTAL_SMD